# Altium schematic sheet LowSideSupply.SchDoc
size A4; CompanyName: Technische Hochschule Nürnberg Georg Simon Ohm; Organization: UltraZohm; Address1: Kesslerplatz 12; Address2: 90489 Nürnberg; Address3: GERMANY; SheetNumber: 5; SheetTotal: 9; Website: www.ultrazohm.com
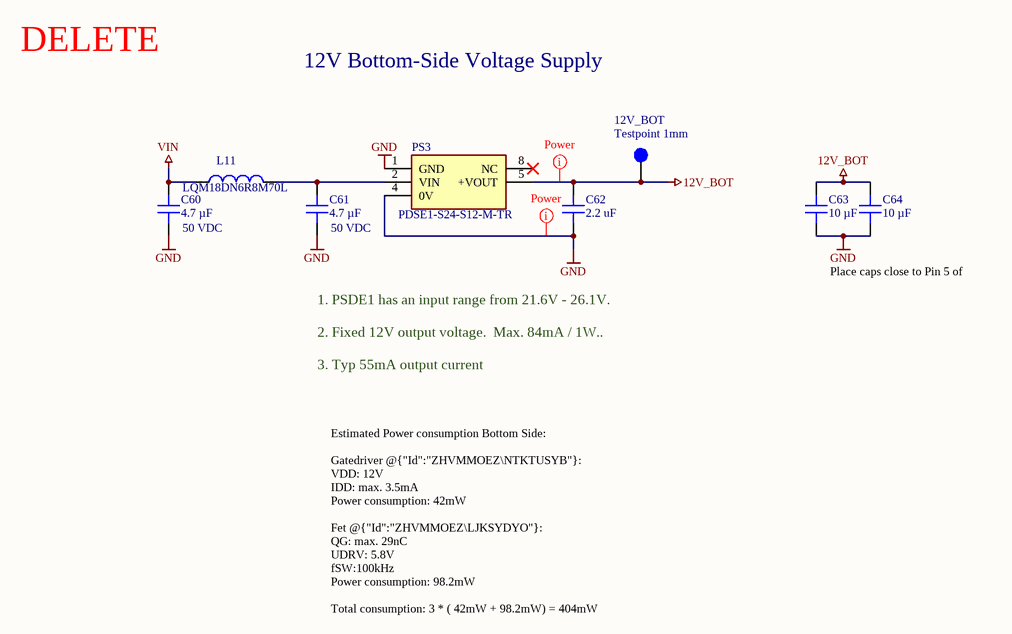
[diagram p0: LowSideSupply.SchDoc]

## Parts
12V_BOT  Testpoint 1mm  [TP_1mm]
C60  4.7 µF  Voltage Rating: 50 VDC  [C_0805]
C61  4.7 µF  Voltage Rating: 50 VDC  [C_0805]
C62  2.2 uF  [C_0603]
C63  10 µF  [C_1210_N]
C64  10 µF  [C_1210_N]
L11  LQM18DN6R8M70L  [INDC1608X95N]
PS3  PDSE1-S24-S12-M-TR  [PDSE1S24S12MTR]

## Nets
12V_BOT: 12V_BOT.1 C62.2 C63.2 C64.2 PS3.5(+VOUT)
GND: C60.2 C61.2 C62.1 C63.1 C64.1 PS3.1(GND) PS3.4(0V)
VIN: C60.1 L11.1
NetC61_1: C61.1 L11.2 PS3.2(VIN)

Not connected (* = marked no-connect by the designer): PS3 8(NC)*

## Layout directives
net class Power: 12V_BOT, GND

## Notes on the sheet
- DELETE
- 12V Bottom-Side Voltage Supply
- Place caps close to Pin 5 of @{"Id":"APOPSXFC\YZVPSHCU"}.
- 1. PSDE1 has an input range from 21.6V - 26.1V.
  2. Fixed 12V output voltage.  Max. 84mA / 1W..
  3. Typ 55mA output current
- Estimated Power consumption Bottom Side:
  Gatedriver @{"Id":"ZHVMMOEZ\NTKTUSYB"}:
  VDD: 12V
  IDD: max. 3.5mA
  Power consumption: 42mW
  Fet @{"Id":"ZHVMMOEZ\LJKSYDYO"}:
  QG: max. 29nC
  UDRV: 5.8V
  fSW:100kHz
  Power consumption: 98.2mW
  Total consumption: 3 * ( 42mW + 98.2mW) = 404mW
- Title
- Revision:
- Design Engineer:
- Date:
- Project:
- Sheet
- of

## Library data of the parts
12V_BOT = NULL: Manufacturer Part Number: NULL; Created from: AGeiger; Created: 2018_06_25_AGeiger; Value: Testpoint 1mm; PartID: 9; Created On: 20.09.2022 13:14:57; Component Type: Testpoint; Last Updated: 20.09.2022 13:15:39; Manufacturer: NULL; Supplier 1: NULL; Supplier Part Number 1: NULL; Type: Testpoint; Live Cycle Status: 1
C60 C61 = C2012X7R1H475K125AC: Capacitor 0805, 50 VDC, 4.7 µF, X7R; Manufacturer: TDK; Tolerance: 10 %; Created from: MGremer; Manufacturer Part Number: C2012X7R1H475K125AC; PartID: 15; Created On: 20.12.2020 13:54:13; ComponentLink1Description: Datasheet; ComponentLink1URL: https://product.tdk.com/info/en/catalog/datasheets/mlcc_commercial_general_en.pdf; Component Type: Capacitor 0805; Device Package: 0805; Last Updated: 20.12.2020 16:34:30; Mounting Type: SMD; Operating Temperature: -55 - 125°C; Series: C; Supplier 1: Mouser; Supplier Part Number 1: 810-C2012X7R475K125C; Type: Capacitor; Value: 4.7 µF; Live Cycle Status: 1; Stock number: Labor SMD Container
C62 = C1608X5R1E225K080AB: Capacitor 0603, 25 VDC, 2.2 uF, X5R; Manufacturer: TDK; Tolerance: 10 %; Voltage Rating: 25VDC; Created from: DHufnagel; Manufacturer Part Number: C1608X5R1E225K080AB; PartID: 96; Created On: 20.07.2022 09:02:16; ComponentLink1Description: Datasheet; ComponentLink1URL: https://product.tdk.com/system/files/dam/doc/product/capacitor/ceramic/mlcc/catalog/mlcc_commercial_general_en.pdf?ref_disty=mouser; Component Type: Capacitor 0603; Device Package: 0603; Last Updated: 20.07.2022 09:02:16; Mounting Type: SMD; Operating Temperature: -55 - 85°C; Series: X5R; Supplier 1: Mouser; Supplier Part Number 1: 810-C1608X5R1E225K; Supplier 2: LCSC; Supplier Part Number 2: C2167215; Type: Capacitor; Value: 2.2 uF; Live Cycle Status: 1; LCSC Part Number: C2167215; Stock number: not stored
C63 C64 = GRM32EC72A106KE05L: Capacitor 1210, 100 VDC, 10µF, X7S; Manufacturer: Murata Electronics; Tolerance: 10 %; Voltage Rating: 100 VDC; Created from: DHufnagel; Manufacturer Part Number: GRM32EC72A106KE05L; PartID: 118; Created On: 21.12.2022 14:25:08; ComponentLink1Description: Datasheet; ComponentLink1URL: https://www.mouser.de/datasheet/2/281/1/GRM32EC72A106KE05_01A-1988109.pdf; Component Type: Capacitor 1210; Device Package: 1210; Last Updated: 21.12.2022 14:25:08; Mounting Type: SMD; Operating Temperature: -55 - 125°C; Series: GRM; Supplier 1: Mouser; Supplier Part Number 1: 81-GRM32EC72A106KE05; Type: Capacitor; Value: 10 µF; Live Cycle Status: 1; Stock number: not stored
L11 = LQM18DN6R8M70L: 6.8µH, 120mA, 0603, 740mOhm, 20%; Manufacturer: Murata; MF: EPCOS / TDK; Value: 6.8uH; DCR: 320m; Rated Current: 0.85 A; Type: fixed inductor; Created from: DHufnagel; MPN: B82464G4154M; Supplier 1: Mouser; Supplier Part Number 1: 81-LQM18DN6R8M70L; Manufacturer Part Number: LQM18DN6R8M70L; PartID: 10; Created On: 19.07.2022 15:47:17; ComponentLink1Description: Datasheet; ComponentLink1URL: https://www.mouser.de/datasheet/2/281/1/JELF243B_0086-2298241.pdf; Component Type: SMD fixed inductor; Device Package: SMD; Last Updated: 19.07.2022 15:47:44; Mounting Type: SMD; Operating Temperature: -40 - 125°C; Series: LQM18DN_70; Supplier 2: Digi-Key; Supplier Part Number 2: 490-LQM18DN6R8M70LCT-ND; DC current: 120mA; Live Cycle Status: 1; Stock number: not stored
PS3 = PDSE1-S24-S12-M-TR: Isolated, 21.6 -26.4Vin, 12V out, 1W, 84mA out; Manufacturer: CUI Inc.; Created from: DHufnagel; Manufacturer Part Number: PDSE1-S24-S12-M-TR; PartID: 21; Created On: 19.07.2022 14:22:00; ComponentLink1Description: Datasheet; ComponentLink1URL: https://www.mouser.de/datasheet/2/670/pdse1_m-1596038.pdf; Component Type: Isolated DC-DC Converter; Device Package: SMT-5; Last Updated: 19.07.2022 14:22:00; Mounting Type: SMT; Operating Temperature: -40 - 105°C; Series: PDSE1-M; Supplier 1: Mouser; Supplier Part Number 1: 490-PDSE1-S24-S12MTR; Supplier 2: Digi-Key; Supplier Part Number 2: 102-PDSE1-S24-S12-M-TRCT-ND; Type: isolated DC-DC Converter; Value: 1 W; Live Cycle Status: 1; Stock number: not stored